# Altium schematic sheet Arduino Mega.SchDoc
size A
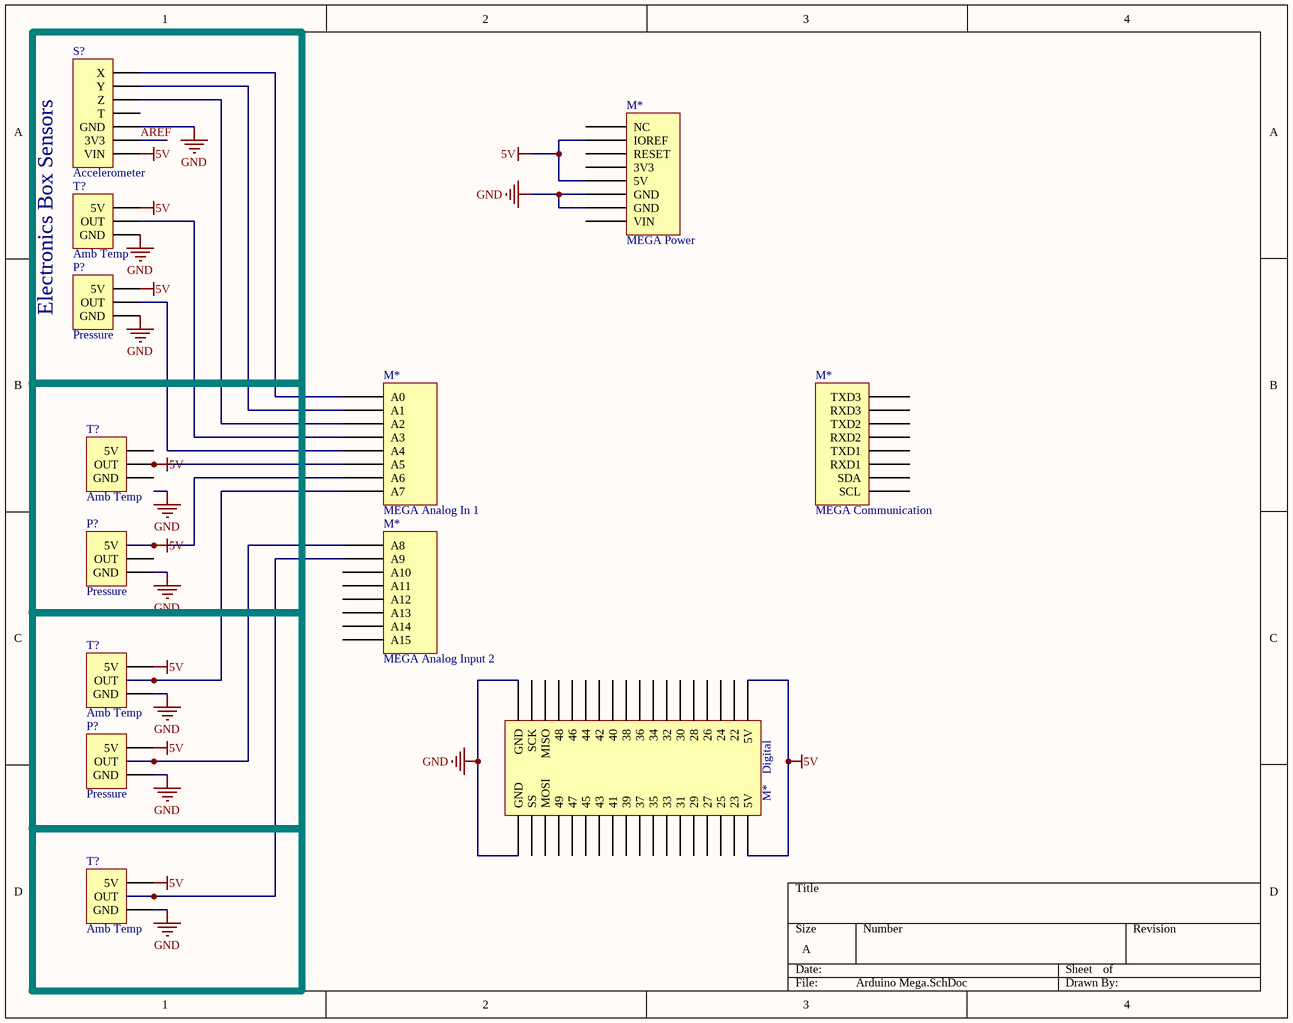
[diagram p0: Arduino Mega.SchDoc]

## Parts
(Parts that share a designator on the sheet are numbered #1, #2 ... from top to bottom, then left to right.)
M*#1  MEGA Power  [Model Name]
M*#2  MEGA Analog In 1  [Model Name]
M*#3  MEGA Communication  [HDR1X8]
M*#4  MEGA Analog Input 2  [Model Name]
M*#5  Digital  [HDR2X18]
P?#1  Pressure  [HDR1X3]
P?#2  Pressure  [HDR1X3]
P?#3  Pressure  [HDR1X3]
S?  Accelerometer  [HDR1X7]
T?#1  Amb Temp  [HDR1X3]
T?#2  Amb Temp  [HDR1X3]
T?#3  Amb Temp  [HDR1X3]
T?#4  Amb Temp  [HDR1X3]

## Blocks framed on the sheet
Electronics Box Sensors: P?#1 S? T?#1

## Nets
5V: M*#1.2(IOREF) M*#1.5(5V) M*#2.6(A5) M*#2.7(A6) M*#5.1(5V) M*#5.2(5V) P?#1.1(5V) P?#2.1(5V) P?#3.1(5V) S?.1(VIN) T?#1.1(5V) T?#2.2(OUT) T?#3.1(5V) T?#4.1(5V)
GND: M*#1.6(GND) M*#1.7(GND) M*#5.35(GND) M*#5.36(GND) P?#1.3(GND) P?#2.3(GND) P?#3.3(GND) S?.3(GND) T?#1.3(GND) T?#3.3(GND) T?#4.3(GND)
AREF: S?.2(3V3)
NetM*#2_1: M*#2.1(A0) S?.7(X)
NetM*#2_2: M*#2.2(A1) S?.6(Y)
NetM*#2_3: M*#2.3(A2) S?.5(Z)
NetM*#2_4: M*#2.4(A3) T?#1.2(OUT)
NetM*#2_5: M*#2.5(A4) P?#1.2(OUT)
NetM*#2_8: M*#2.8(A7) T?#3.2(OUT)
NetM*#4_1: M*#4.1(A8) P?#3.2(OUT)
NetM*#4_2: M*#4.2(A9) T?#4.2(OUT)

Not connected (* = marked no-connect by the designer): M*#1 1(NC) 3(RESET) 4(3V3) 8(VIN); M*#3 1(TXD3) 2(RXD3) 3(TXD2) 4(RXD2) 5(TXD1) 6(RXD1) 7(SDA) 8(SCL); M*#4 3(A10) 4(A11) 5(A12) 6(A13) 7(A14) 8(A15); M*#5 3(44) 4(23) 5(22) 6(25) 7(26) 8(27) 9(28) 10(29) 11(30) 12(31) 13(32) 14(33) 15(34) 16(35) 17(36) 18(37) 19(38) 20(39) 21(40) 22(41) 23(42) 24(43) 25(24) 26(45) 27(46) 28(47) 29(48) 30(49) 31(MISO) 32(MOSI) 33(SCK) 34(SS); P?#2 2(OUT); S? 4(T); T?#2 1(5V) 3(GND)

## Library data of the parts
M*#1-M*#5 = Component_1
P?#1-P?#3 T?#1-T?#4 = Header 3: Header, 3-Pin; LatestRevisionDate: 17-Jul-2002; LatestRevisionNote: Re-released for DXP Platform.; Publisher: Altium Limited
S? = Header 7: Header, 7-Pin; LatestRevisionDate: 17-Jul-2002; LatestRevisionNote: Re-released for DXP Platform.; Publisher: Altium Limited